# Altium schematic sheet SheetCircuito.SchDoc
size A4; SheetNumber: 1; SheetTotal: 2
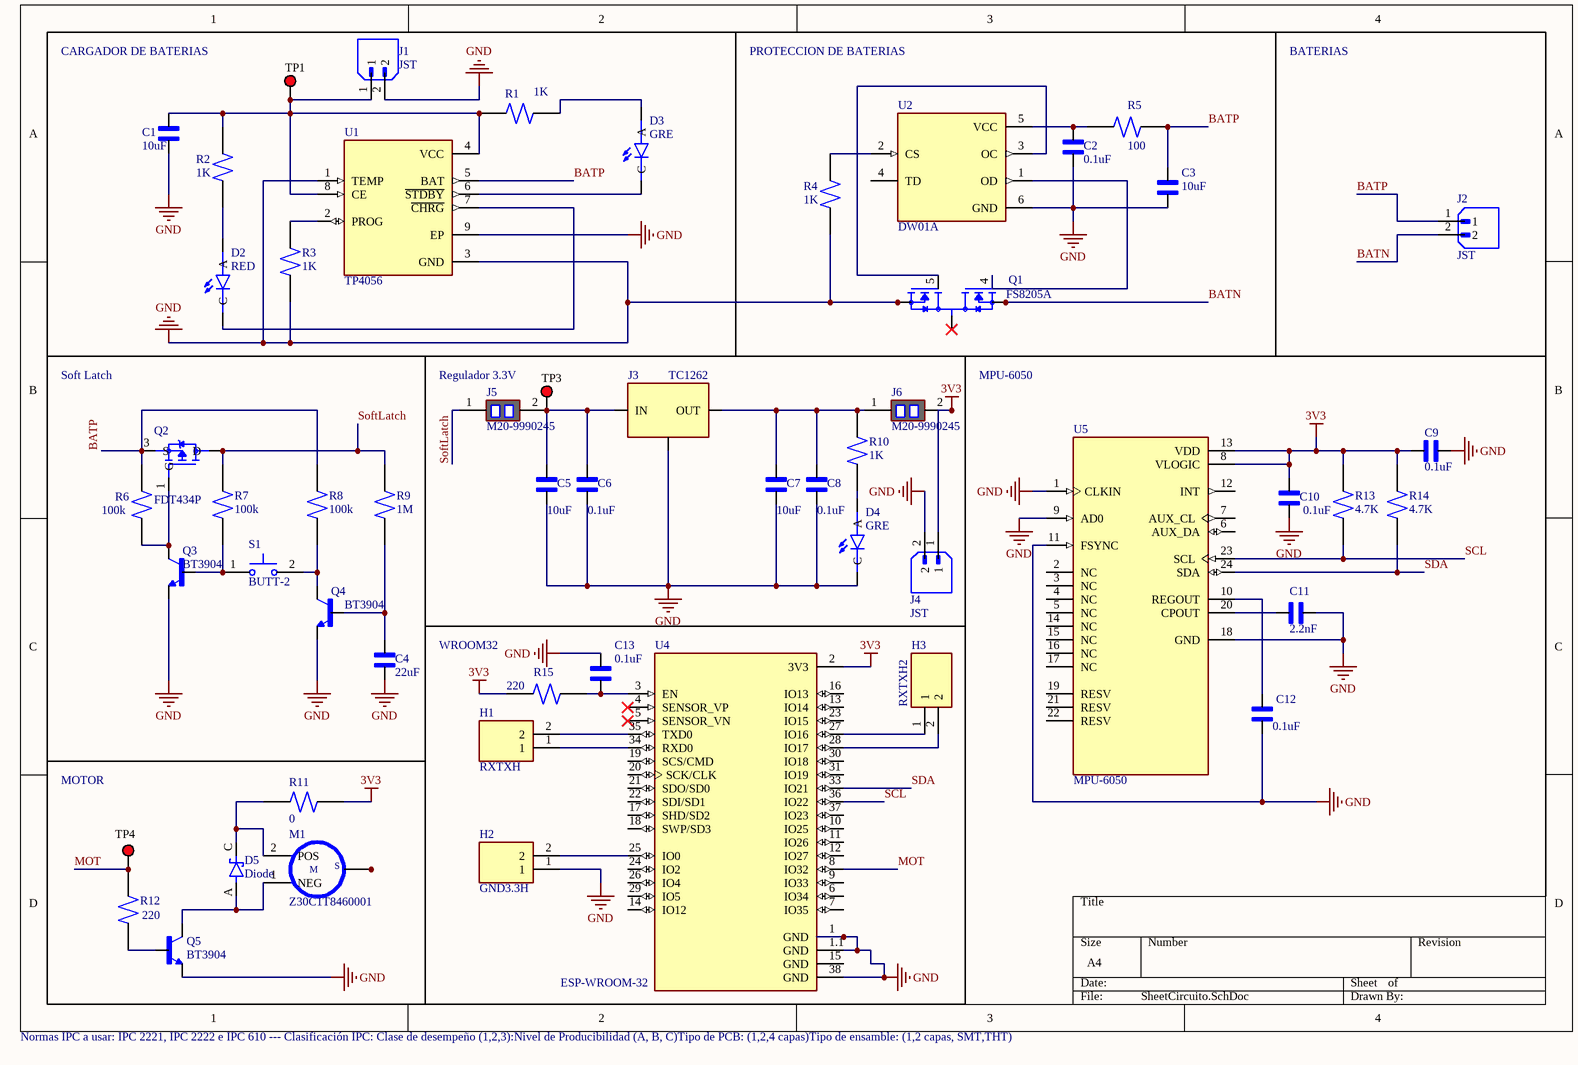
[diagram p0: SheetCircuito.SchDoc]

## Parts
C1  10uF  [CAPC2012X94N]
C2  0.1uF  [CAPC2012X94N]
C3  10uF  [CAPC2012X94N]
C4  22uF  [CAPC2012X94N]
C5  10uF  [CAPC2012X94N]
C6  0.1uF  [CAPC2012X94N]
C7  10uF  [CAPC2012X94N]
C8  0.1uF  [CAPC2012X94N]
C9  0.1uF  [CAPC2012X94N]
C10  0.1uF  [CAPC2012X94N]
C11  2.2nF  [CAPC2012X94N]
C12  0.1uF  [CAPC2012X94N]
C13  0.1uF  [CAPC2012X94N]
D2  RED  [LED_WP7113SRD/D]
D3  GRE  [LED_WP7113SRD/D]
D4  GRE  [LED_WP7113SRD/D]
D5  Diode  [DIOSC130X200X100-2N]
H1  RXTXH  [TE_3-644456-2]
H2  GND3.3H  [TE_3-644456-2]
H3  RXTXH2  [TE_3-644456-2]
J1  JST  [JST_B2B-XH-A_(LF)(SN)]
J2  JST  [JST_B2B-XH-A_(LF)(SN)]
J3  TC1262  [SOT-223-3]
J4  JST  [JST_B2B-XH-A_(LF)(SN)]
J5  M20-9990245  [HEADER 2P]
J6  M20-9990245  [HEADER 2P]
M1  Z30C1T8460001  [XDCR_Z30C1T8460001]
Q1  FS8205A  [SOP65P640X120-8N]
Q2  FDT434P  [SOT230P700X180-4N - duplicate]
Q3  BT3904  [SOT95P230X110-3N]
Q4  BT3904  [SOT95P230X110-3N]
Q5  BT3904  [SOT95P230X110-3N]
R1  1K  [RESC2012X60N]
R2  1K  [RESC2012X60N]
R3  1K  [RESC2012X60N]
R4  1K  [RESC2012X60N]
R5  100  [RESC2012X60N]
R6  100k  [RESC2012X60N]
R7  100k  [RESC2012X60N]
R8  100k  [RESC2012X60N]
R9  1M  [RESC2012X60N]
R10  1K  [RESC2012X60N]
R11  0  [RESC2012X60N]
R12  220  [RESC2012X60N]
R13  4.7K  [RESC2012X60N]
R14  4.7K  [RESC2012X60N]
R15  220  [RESC2012X60N]
S1  BUTT-2  [SW_BUTT-2]
TP1  5010  [TESTPOINT]  (value not drawn)
TP3  5010  [TESTPOINT]  (value not drawn)
TP4  5010  [TESTPOINT]  (value not drawn)
U1  TP4056  [SOP127P600X175-9N]
U2  DW01A  [SOT95P280X145-6N]
U4  ESP-WROOM-32  [MODULE_ESP-WROOM-32]
U5  MPU-6050  [QFN50P400X400X95-24N - duplicate]

## Blocks framed on the sheet
CARGADOR DE BATERIAS: C1 D2 D3 J1 R1-R3 TP1 U1
MOTOR: D5 M1 Q5 R11 R12 TP4

## Nets
3V3: C9.1 C10.2 J4.1 J6.2 R11.2 R13.2 R14.2 R15.1 U4.2(3V3) U5.8(VLOGIC) U5.13(VDD)
GND: C1.1 C2.2 C3.1 C4.1 C5.1 C6.1 C7.1 C8.1 C9.2 C10.1 C11.1 C12.1 C13.2 D4.C H2.1 J1.2 J3.2(GND) J4.2 Q1.6(S2) Q1.7(S2) Q3.E Q4.E Q5.E R3.1 R4.1 U1.1(TEMP) U1.3(GND) U1.9(EP) U2.6(GND) U4.1(GND) U4.1.1(GND) U4.38(GND) U5.1(CLKIN) U5.9(AD0) U5.11(FSYNC) U5.18(GND)
BATN: J2.2 Q1.2(S1) Q1.3(S1)
BATP: C3.2 J2.1 Q2.3(S) R5.2 R6.2 R8.2 U1.5(BAT)
MOT: R12.2 TP4.1 U4.8(IO32)
SCL: R13.1 U4.36(IO22) U5.23(SCL)
SDA: R14.1 U4.33(IO21) U5.24(SDA)
SoftLatch: J5.1 Q2.2(D) Q2.4(D) R7.2 R9.2
NetC1_2: C1.2 J1.1 R1.1 R2.2 TP1.1 U1.4(VCC) U1.8(CE)
NetC2_1: C2.1 R5.1 U2.5(VCC)
NetC4_2: C4.2 Q4.B R9.1
NetC5_2: C5.2 C6.2 J3.1(IN) J5.2 TP3.1
NetC7_2: C7.2 C8.2 J3.3(OUT) J6.1 R10.2
NetC11_2: C11.2 U5.20(CPOUT)
NetC12_2: C12.2 U5.10(REGOUT)
NetC13_1: C13.1 R15.2 U4.3(EN)
NetD2_A: D2.A R2.1
NetD2_C: D2.C U1.7(~{CHRG})
NetD3_A: D3.A R1.2
NetD3_C: D3.C U1.6(~{STDBY})
NetD4_A: D4.A R10.1
NetD5_A: D5.A M1.1(NEG) Q5.C
NetD5_C: D5.C(K) M1.2(POS) R11.1
NetH1_1: H1.1 U4.34(RXD0)
NetH1_2: H1.2 U4.35(TXD0)
NetH2_2: H2.2 U4.25(IO0)
NetH3_1: H3.1 U4.27(IO16)
NetH3_2: H3.2 U4.28(IO17)
NetM1_3: M1.3(SHIELD) M1.4(SHIELD) M1.5(SHIELD) M1.6(SHIELD)
NetQ1_1: Q1.1(D12) Q1.8(D12)
NetQ1_4: Q1.4(G1) U2.1(OD)
NetQ1_5: Q1.5(G2) U2.3(OC)
NetQ2_1: Q2.1(G) Q3.C R6.1
NetQ3_B: Q3.B R7.1 S1.1
NetQ4_C: Q4.C R8.1 S1.2
NetQ5_B: Q5.B R12.1
NetR3_2: R3.2 U1.2(PROG)
NetR4_2: R4.2 U2.2(CS)

Not connected (* = marked no-connect by the designer): U2 4(TD); U4 4(SENSOR_VP)* 5(SENSOR_VN)* 6(IO34) 7(IO35) 9(IO33) 10(IO25) 11(IO26) 12(IO27) 13(IO14) 14(IO12) 15(GND) 16(IO13) 17(SHD/SD2) 18(SWP/SD3) 19(SCS/CMD) 20(SCK/CLK) 21(SDO/SD0) 22(SDI/SD1) 23(IO15) 24(IO2) 26(IO4) 29(IO5) 30(IO18) 31(IO19) 37(IO23); U5 2(NC) 3(NC) 4(NC) 5(NC) 6(AUX_DA) 7(AUX_CL) 12(INT) 14(NC) 15(NC) 16(NC) 17(NC) 19(RESV) 21(RESV) 22(RESV)

## Notes on the sheet
- PROTECCION DE BATERIAS
- BATERIAS
- Soft Latch
- Regulador 3.3V
- MPU-6050
- WROOM32
- Normas IPC a usar: IPC 2221, IPC 2222 e IPC 610 --- Clasificación IPC: Clase de desempeño (1,2,3):Nivel de Producibilidad (A, B, C)Tipo de PCB: (1,2,4 capas)Tipo de ensamble: (1,2 capas, SMT,THT)
- (in symbol Z30C1T8460001) M; S

## Library data of the parts
C1-C13 = 0805YC103J4T2A: 10000 pF Â±5% 16V Ceramic Capacitor X7R 0805 (2012 Metric); MF: AVX; SnapEDA_Link: https://www.snapeda.com/parts/0805YC103J4T2A/AVX/view-part/?ref=snap; Package: 2012 AVX; Value: *; MP: 0805YC103J4T2A; Check_prices: https://www.snapeda.com/parts/0805YC103J4T2A/AVX/view-part/?ref=eda
D2-D4 = WP7113SRD/D: Red 640nm LED Indication - Discrete 1.85V Radial; MF: Kingbright; SnapEDA_Link: https://www.snapeda.com/parts/WP7113SRD/D/Kingbright/view-part/?ref=snap; Package: Radial Kingbright; Value: *; MP: WP7113SRD/D; Check_prices: https://www.snapeda.com/parts/WP7113SRD/D/Kingbright/view-part/?ref=eda
D5 = SD0805S040S0R1: Diode Schottky 40V 100mA (DC) Surface Mount 0805 (2012 Metric); MF: AVX; DigiKey-Purchase-URL: https://snapeda.com/shop?store=DigiKey&id=809038; Arrow_Electronics-Purchase-URL: https://snapeda.com/shop?store=Arrow+Electronics&id=809038; Availability: Good; Price: None; Value: *; SnapEDA_Link: https://www.snapeda.com/parts/SD0805S040S0R1/AVX/view-part/809038/?ref=snap; MP: SD0805S040S0R1; Package: 0805 AVX; Mouser-Purchase-URL: https://snapeda.com/shop?store=Mouser&id=809038
H1-H3 = 3-644456-2: HEADER ASSEMBLY, NARROW, MTA-100, 2 POSITION, STRAIGHT | TE Connectivity 3-644456-2; SnapEDA_Link: https://www.snapeda.com/parts/3-644456-2/TE+Connectivity+AMP+Connectors/view-part/?ref=snap; Package: None; Value: *; MF: TE Connectivity; MP: 3-644456-2; Check_prices: https://www.snapeda.com/parts/3-644456-2/TE+Connectivity+AMP+Connectors/view-part/?ref=eda
J1 J2 J4 = B2B-XH-A_(LF)(SN): Connector Header Through Hole 2 position 0.098 (2.50mm); MF: JST Sales; MP: B2B-XH-A (LF)(SN); SnapEDA_Link: https://www.snapeda.com/parts/B2B-XH-A%20(LF)(SN)/JST+Sales+America+Inc./view-part/?ref=snap; Package: None; Value: *; Check_prices: https://www.snapeda.com/parts/B2B-XH-A%20(LF)(SN)/JST+Sales+America+Inc./view-part/?ref=eda
J3 = TC1262-3.3VDB: Linear Voltage Regulator IC Positive Fixed 1 Output 500mA SOT-223-3; MF: Microchip; Value: *; SnapEDA_Link: https://www.snapeda.com/parts/TC1262-3.3VDB/Microchip/view-part/?ref=snap; MP: TC1262-3.3VDB; Purchase-URL: https://pricing.snapeda.com/search/part/TC1262-3.3VDB/?ref=eda; Check_prices: https://www.snapeda.com/parts/TC1262-3.3VDB/Microchip/view-part/?ref=eda; Availability: In Stock; Price: None; Package: SOT-223 Microchip Technology
J5 J6 = SHUNT: CONN HEADER VERT 2POS 2.54MM; Working Voltage: 750V; Gender: Male; Number of Poles: 2; Current Rating: 3A; Mated Stacking Heights: 16.54mm; Contact Resistance: 25mR; Connector Type: Male Pin; Insulation Resistance: 10GR; Mating Cycles: 300; Voltage: 50V; Flammability Rating: UL94 V-0; Pitch: 2.54mm; Series: M20; Number of Contacts: 2; Height: 0.12inch; Min Operating Temperature: -40°C; Contact Finish - Mating: GOLD; Number of Positions: 2; Number of Rows: 1; Packaging: Bulk; Package Quantity: 1000; Voltage Rating (AC): 750V; Current: 3A; Mount: Through Hole; Case/Package: SIL; Orientation: Straight; Contact Shape: Square; Weight: 0.25lb; Radiation Hardening: No; Fastening Type: Pull; Length: 5.08mm; Depth: 2.54mm; Contact Mating Length: 0.24inch; Housing Material: Nylon; Reach SVHC Compliant: Yes; Insulation Material: Nylon; Color: Black; Width: 0.25inch; Insulation Color: Black; Contact Material: Brass; Contact Type: Male Pin; Termination: Solder; Max Operating Temperature: 105°C; Contact Plating: Gold; Housing Color: Black; Max Current Rating: 3A; Lead Pitch: 2.54mm
M1 = Z30C1T8460001: DC Motor Vibration, ERM 15000 RPM 2.7VDC; MF: Jinlong Machinery; Package: Jinlong Machinery &amp; Electronics; SnapEDA_Link: https://www.snapeda.com/parts/Z30C1T8460001/Jinlong%20Machinery%20%26%20Electronics%2C%20Inc./view-part/585010/?ref=snap; MP: Z30C1T8460001; Value: *; Availability: Unavailable; Price: None
Q1 = FS8205A: MF: Fortune Semiconductor; SnapEDA_Link: https://www.snapeda.com/parts/FS8205A/Fortune+Semiconductor/view-part/?ref=snap; Package: Package; Value: *; MP: FS8205A; Check_prices: https://www.snapeda.com/parts/FS8205A/Fortune+Semiconductor/view-part/?ref=eda
Q2 = FDT434P: P-Channel 20 V 6A (Ta) 3W (Ta) Surface Mount SOT-223-4; MF: ON; SnapEDA_Link: https://www.snapeda.com/parts/FDT434P/Onsemi/view-part/?ref=snap; Package: SOT-223-4 Fairchild Semiconductor; Value: *; MP: FDT434P; Check_prices: https://www.snapeda.com/parts/FDT434P/Onsemi/view-part/?ref=eda
Q3-Q5 = MMBT3904-7-F: NPN SMALL SIGNAL SURFACE MOUNT TRANSISTOR; Package: None; Price: None; Availability: Unavailable; MP: MMBT3904-7-F; Value: *
R1-R15 = RC0805FR-07910RL: 910 Ohms Â±1% 0.125W, 1/8W Chip Resistor 0805 (2012 Metric) Moisture Resistant Thick Film; MF: Yageo; Package: 2012 Rohm Semiconductor; Value: *; Purchase-URL: https://pricing.snapeda.com/search/part/RC0805FR-07910RL/?ref=eda; Availability: In Stock; MP: RC0805FR-07910RL; Price: None
S1 = BUTT-2: Tactile Switches MINI PUSH BUTTON SWITCH 2-PIN QTY. 4; MF: Gravitech; Purchase-URL: https://pricing.snapeda.com/search/part/BUTT-2/?ref=eda; Package: None; Value: *; Check_prices: https://www.snapeda.com/parts/BUTT-2/Gravitech/view-part/?ref=eda; SnapEDA_Link: https://www.snapeda.com/parts/BUTT-2/Gravitech/view-part/?ref=snap; Availability: In Stock; Price: None; MP: BUTT-2
TP1 TP3 TP4 = TestPointRed: Test Point, Red, Through Hole, RoHS, Bulk; Manufacturer: Keystone; Contact Material: Bronze; Mounting Technology: Through Hole; RoHSCompliant: true; Pins: 1; Package Quantity: 100; ComponentLink2Description: Datasheet; Height: 8.12 mm; ComponentLink1URL: http://www.keyelco.com/; DatasheetVersion: Rev. F, 12/2013; Mount: Through Hole; PackageReference: 5010; Contact Plating: Silver; Packaging: Bulk; Colour: Red; REACH SVHC: No SVHC; PackageDescription: 1-Pin Through Hole Device, Dia 3.17 mm; ComponentLink2URL: http://www.keyelco.com/product-pdf.cfm?p=1319; ComponentLink1Description: Manufacturer URL
U1 = TP4056: Complete single cell Li-Ion battery with a constant current / constant voltage linear charger; MF: NanJing Top Power ASIC Corp.; Check_prices: https://www.snapeda.com/parts/TP4056/NanJing+Top+Power+ASIC+Corp./view-part/?ref=eda; SnapEDA_Link: https://www.snapeda.com/parts/TP4056/NanJing+Top+Power+ASIC+Corp./view-part/?ref=snap; Price: None; Availability: Not in stock; Package: Package; MP: TP4056; Value: *
U2 = DW01A: One Cell Lithium-ion/Polymer Battery Protection IC; MF: Fortune Semiconductor; SnapEDA_Link: https://www.snapeda.com/parts/DW01A/Fortune+Semiconductor/view-part/?ref=snap; Package: SOT-23-6 Fortune Semiconductor; Value: *; MP: DW01A; Check_prices: https://www.snapeda.com/parts/DW01A/Fortune+Semiconductor/view-part/?ref=eda
U4 = ESP-WROOM-32: Transceptor serie ESP-WROOM-32; Placa de evaluaciÃ³n 802.11 b/g/n (Wi-Fi, WiFi, WLAN), BluetoothÂ® Smart 4.x de bajo consumo (BLE); MF: Espressif Systems; SnapEDA_Link: https://www.snapeda.com/parts/ESP-WROOM-32/Espressif+Systems/view-part/?ref=snap; Package: Module Espressif Systems; Value: *; MP: ESP-WROOM-32; Check_prices: https://www.snapeda.com/parts/ESP-WROOM-32/Espressif+Systems/view-part/?ref=eda
U5 = MPU-6050: MPU-6050 series Accelerometer, Gyroscope, 3 Axis Sensor Evaluation Board; MF: TDK InvenSense; SnapEDA_Link: https://www.snapeda.com/parts/MPU-6050/TDK+InvenSense/view-part/?ref=snap; Package: QFN-24 InvenSense; Value: *; MP: MPU-6050; Check_prices: https://www.snapeda.com/parts/MPU-6050/TDK+InvenSense/view-part/?ref=eda